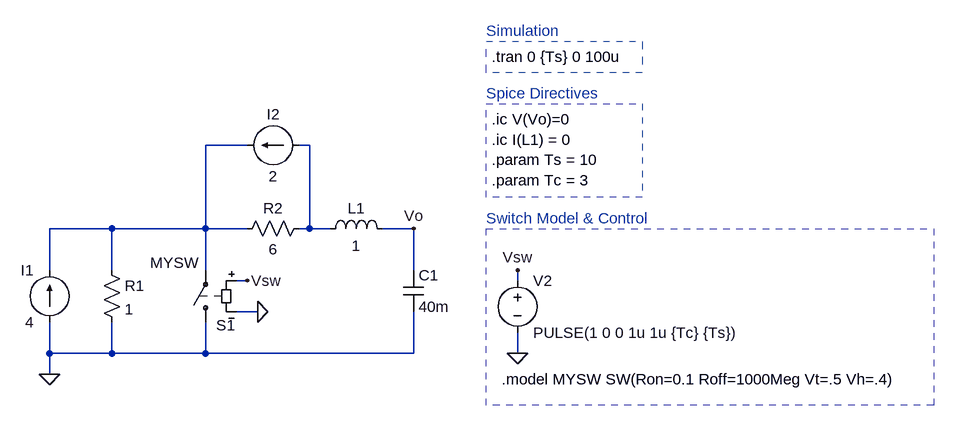
[diagram p0: schematic Example_2_RLC.asc]
Example_2_RLC.asc, the LTspice schematic file:
Version 4
SHEET 1 1532 760
WIRE 272 224 208 224
WIRE 368 224 352 224
WIRE 64 352 -32 352
WIRE 208 352 208 224
WIRE 208 352 64 352
WIRE 272 352 208 352
WIRE 368 352 368 224
WIRE 368 352 352 352
WIRE 400 352 368 352
WIRE 528 352 480 352
WIRE -32 416 -32 352
WIRE 64 416 64 352
WIRE 208 416 208 352
WIRE 528 416 528 352
WIRE 272 432 256 432
WIRE 688 432 688 416
WIRE 288 480 256 480
WIRE -32 544 -32 496
WIRE 64 544 64 496
WIRE 64 544 -32 544
WIRE 208 544 208 496
WIRE 208 544 64 544
WIRE 528 544 528 480
WIRE 528 544 208 544
WIRE 688 544 688 512
WIRE -32 576 -32 544
FLAG 288 480 0
FLAG 272 432 Vsw
FLAG 688 416 Vsw
FLAG 688 544 0
FLAG -32 576 0
FLAG 528 352 Vo
SYMBOL sw 208 512 R180
WINDOW 0 -46 11 Left 2
WINDOW 3 85 107 Right 2
SYMATTR InstName S1
SYMATTR Value MYSW
SYMBOL voltage 688 416 R0
WINDOW 123 0 0 Left 0
WINDOW 39 0 0 Left 0
SYMATTR InstName V2
SYMATTR Value PULSE(1 0 0 1u 1u {Tc} {Ts})
SYMBOL current -32 496 R180
WINDOW 0 24 80 Left 2
WINDOW 3 24 0 Left 2
SYMATTR InstName I1
SYMATTR Value 4
SYMBOL res 48 400 R0
SYMATTR InstName R1
SYMATTR Value 1
SYMBOL res 256 368 R270
WINDOW 0 32 56 VTop 2
WINDOW 3 0 56 VBottom 2
SYMATTR InstName R2
SYMATTR Value 6
SYMBOL ind 384 368 R270
WINDOW 0 32 56 VTop 2
WINDOW 3 5 56 VBottom 2
SYMATTR InstName L1
SYMATTR Value 1
SYMBOL cap 512 416 R0
SYMATTR InstName C1
SYMATTR Value 40m
SYMBOL current 352 224 R90
WINDOW 0 -32 40 VBottom 2
WINDOW 3 32 40 VTop 2
SYMATTR InstName I2
SYMATTR Value 2
TEXT 640 48 Left 2 ;Simulation
TEXT 648 88 Left 2 !.tran 0 {Ts} 0 100u
TEXT 640 144 Left 2 ;Spice Directives
TEXT 664 584 Left 2 !.model MYSW SW(Ron=0.1 Roff=1000Meg Vt=.5 Vh=.4)
TEXT 648 184 Left 2 !.ic V(Vo)=0\n.ic I(L1) = 0\n.param Ts = 10\n.param Tc = 3
TEXT 640 336 Left 2 ;Switch Model & Control
RECTANGLE Normal 880 112 640 64 2
RECTANGLE Normal 1328 624 640 352 2
RECTANGLE Normal 880 304 640 160 2

The netlist it stands for:
* Example_2_RLC.asc
S1 0 N001 Vsw 0 MYSW
V2 Vsw 0 PULSE(1 0 0 1u 1u {Tc} {Ts})
I1 0 N001 4
R1 N001 0 1
R2 N001 N002 6
L1 N002 Vo 1
C1 Vo 0 40m
I2 N002 N001 2
* Simulation
.tran 0 {Ts} 0 100u
* Spice Directives
.model MYSW SW(Ron=0.1 Roff=1000Meg Vt=.5 Vh=.4)
.ic V(Vo)=0
.ic I(L1) = 0
.param Ts = 10
.param Tc = 3
* Switch Model & Control
.backanno
.end